# EasyEDA Pro project FrameworkGPU to MXM v0.34.epro, board PCB8
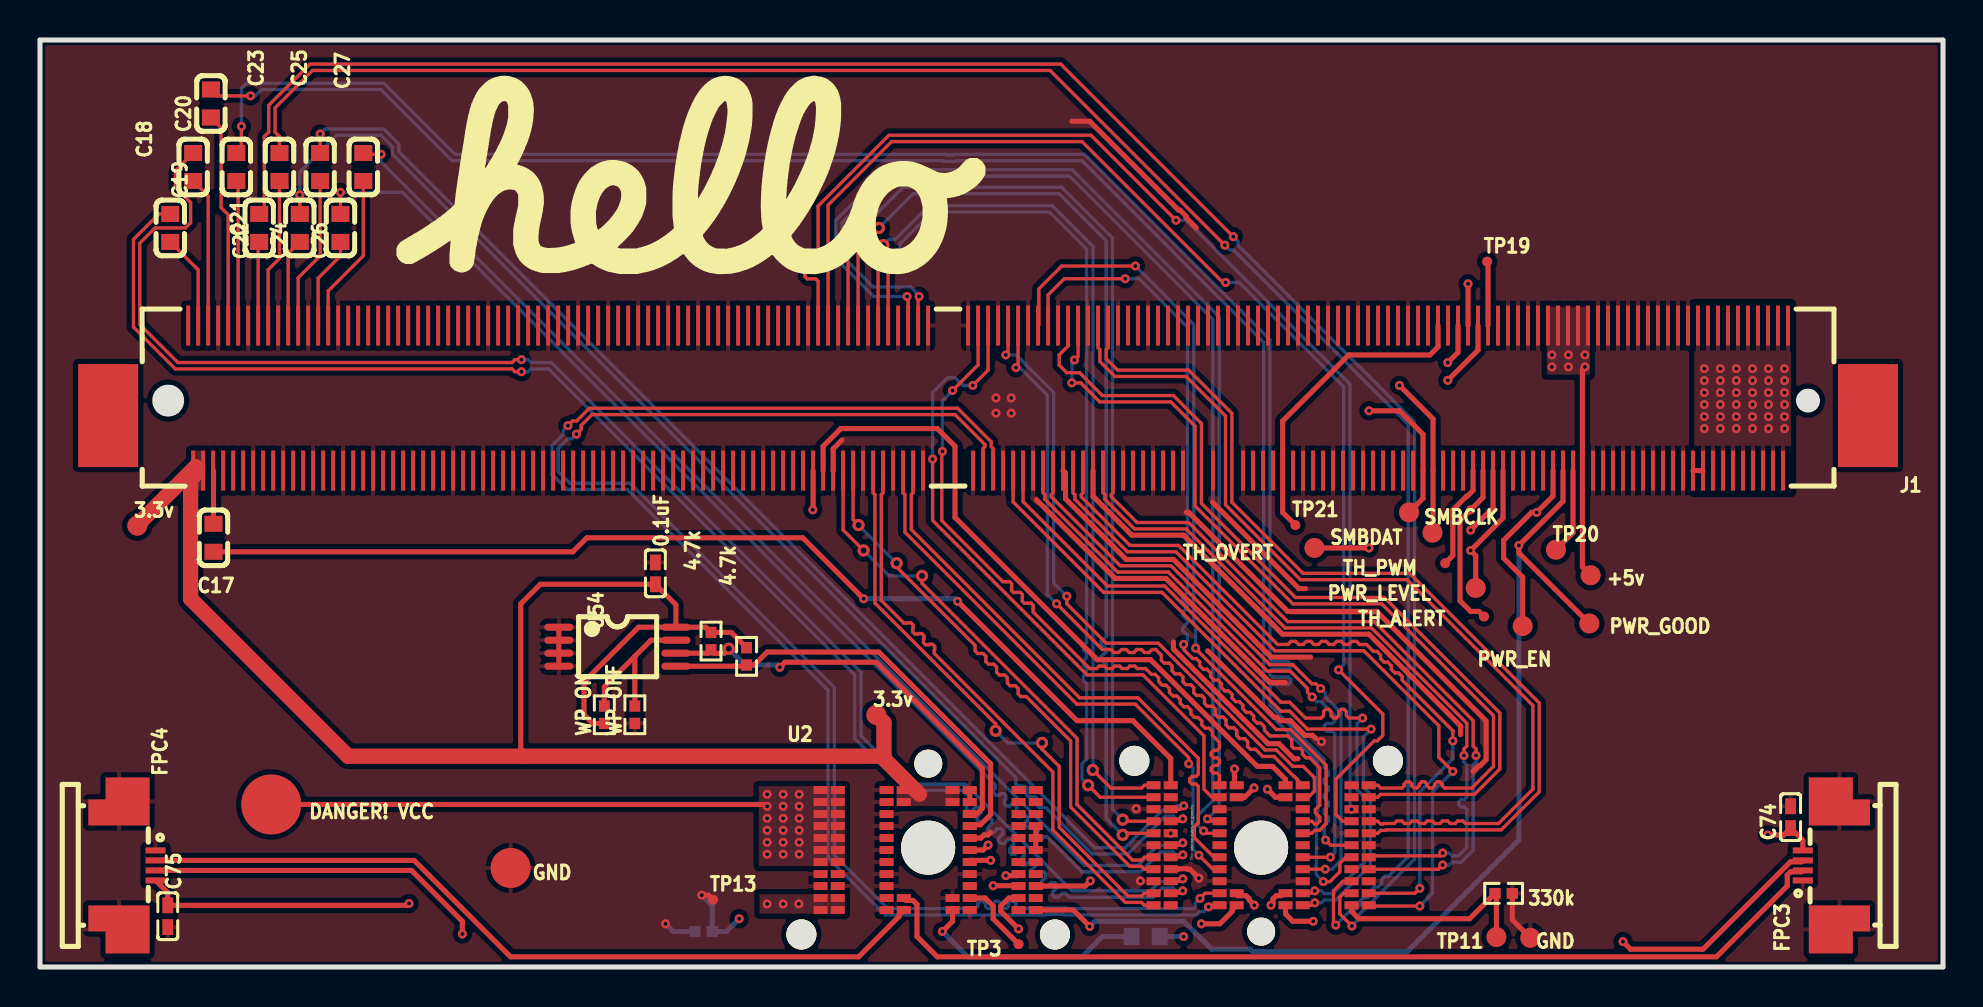
[diagram p10: board, top side]
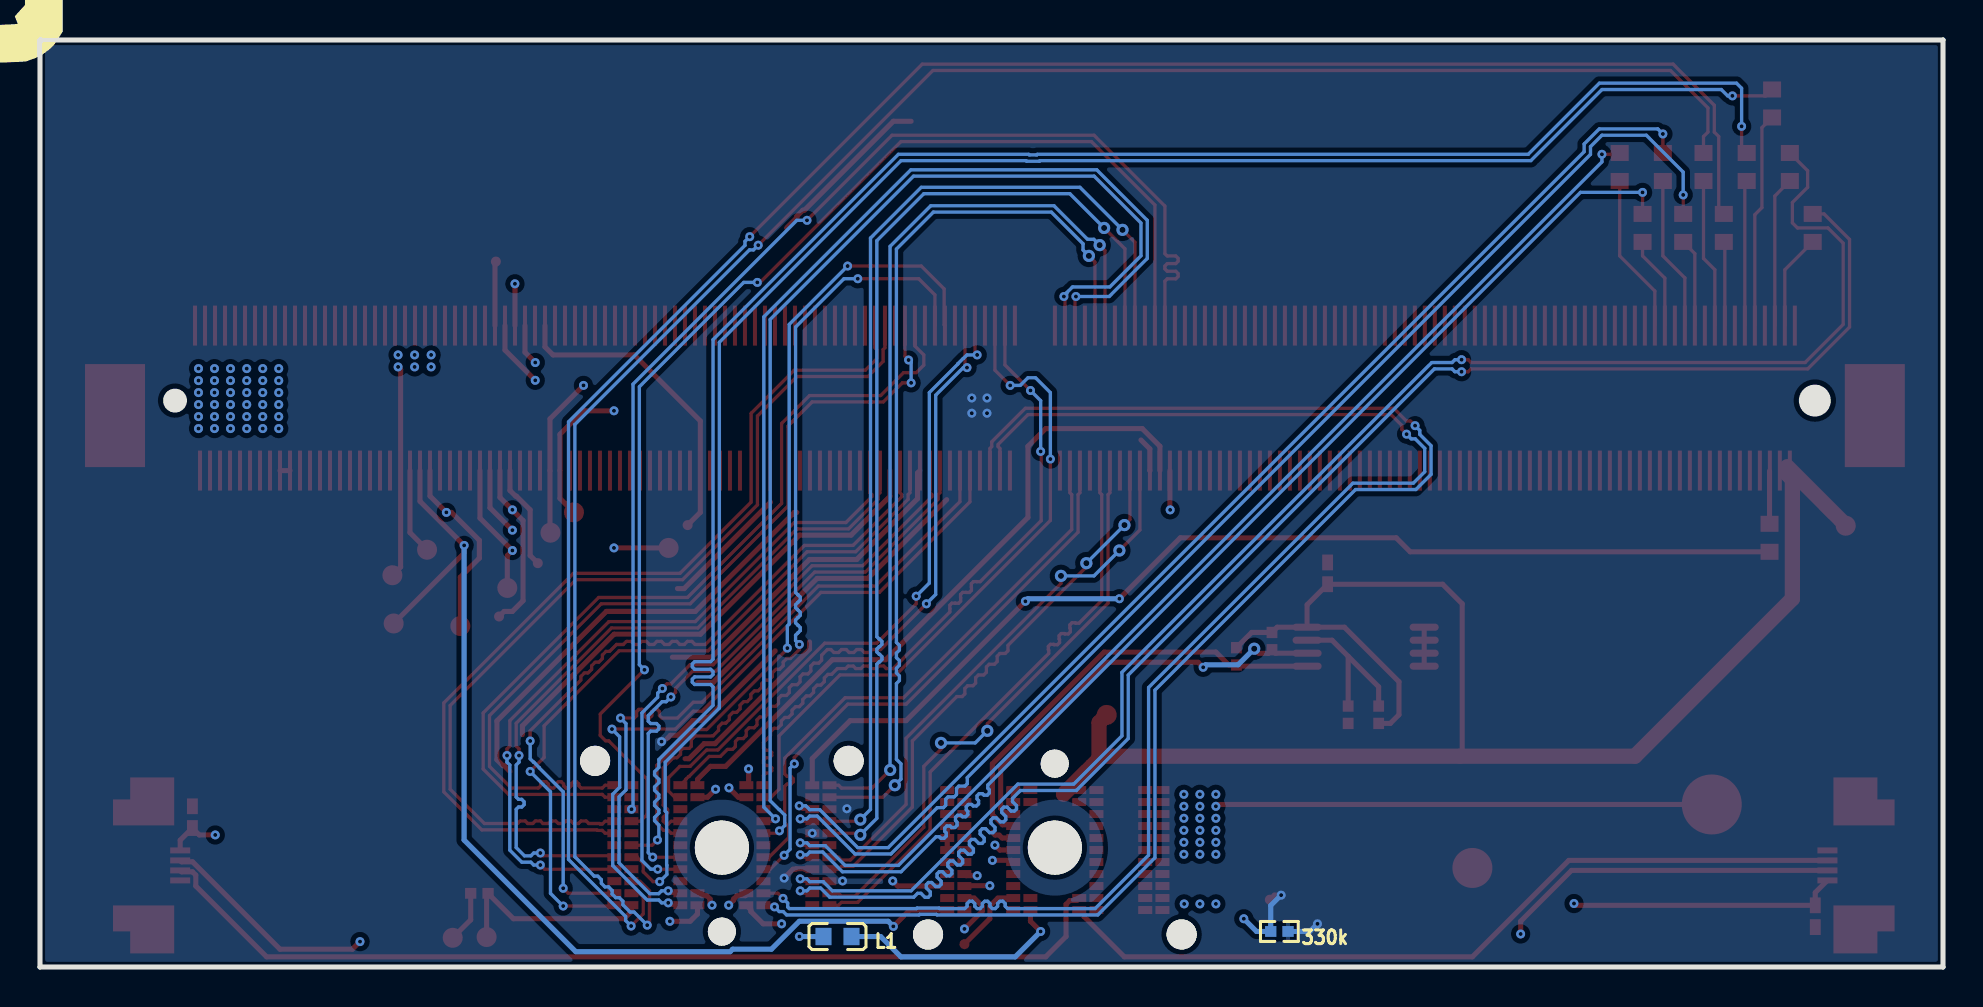
[diagram p11: board, bottom side, seen from below]

Outline 95.16 x 46.36 mm; copper layers: Top Layer, Inner1, Inner2, Inner3, Inner4, Bottom Layer. Coordinates in mm from the lower left corner of the outline.
Outline path: 0,46.36 95.16,46.36 95.16,0 0,0 0,46.36
Stack: Top Layer 0.035mm Outer layer thickness 1oz / Dielectric1 0.0994mm 3313 RC57% 4.2mil / Inner1 0.0152mm Inner layer thickness / Dielectric2 0.55mm 0.55mm H/H No copper / Inner2 0.0152mm Inner layer thickness / Dielectric3 0.1088mm 2116 RC54% 4.9mil / Inner3 0.0152mm Inner layer thickness / Dielectric4 0.55mm 0.55mm H/H No copper / Inner4 0.0152mm Inner layer thickness / Dielectric5 0.0994mm 3313 RC57% 4.2mil / Bottom Layer 0.035mm Outer layer thickness 1oz

## Design rules (mm)
net DP_A_AUXP: DP_A_AUX
net DP_A_AUXN: DP_A_AUX
net DP_A_L3P: DP_A_L3
net DP_A_L3N: DP_A_L3
net DP_A_L2P: DP_A_L2
net DP_A_L2N: DP_A_L2
net DP_A_L1P: DP_A_L1
net DP_A_L1N: DP_A_L1
net DP_A_L0P: DP_A_L0
net DP_A_L0N: DP_A_L0
net PEX_REFCLK+: DP2
net PEX_REFCLK-: DP2
net PCIE_TX_0P: PCIE_TX_0
net PCIE_RX_0P: PCIE_RX_0
net PCIE_TX_0N: PCIE_TX_0
net PCIE_RX_0N: PCIE_RX_0
net PCIE_TX_1P: PCIE_TX_1
net PCIE_RX_1P: PCIE_RX_1
net PCIE_TX_1N: PCIE_TX_1
net PCIE_RX_1N: PCIE_RX_1
net PCIE_TX_2P: PCIE_TX_2
net PCIE_RX_2P: PCIE_RX_2
net PCIE_TX_2N: PCIE_TX_2
net PCIE_RX_2N: PCIE_RX_2
net PCIE_RX_3P: PCIE_RX_3
net PCIE_TX_3P: PCIE_TX_3
net PCIE_RX_3N: PCIE_RX_3
net PCIE_TX_3N: PCIE_TX_3
net PCIE_RX_4P: PCIE_RX_4
net PCIE_TX_4P: PCIE_TX_4
net PCIE_RX_4N: PCIE_RX_4
net PCIE_TX_4N: PCIE_TX_4
net PCIE_RX_5P: PCIE_RX_5
net PCIE_TX_5P: PCIE_TX_5
net PCIE_RX_5N: PCIE_RX_5
net PCIE_TX_5N: PCIE_TX_5
net PCIE_RX_6P: DP1
net PCIE_TX_6P: PCIE_TX_6
net PCIE_RX_6N: DP1
net PCIE_TX_6N: PCIE_TX_6
net PCIE_RX_7P: PCIE_RX_7
net PCIE_TX_7P: PCIE_TX_7
net PCIE_RX_7N: PCIE_RX_7
net PCIE_TX_7N: PCIE_TX_7
template: Custom Config
spacing copperThickness1oz (default): track to track 0.102, other pairs 0.152 to 0.3
spacing copperThickness2oz: track to track 0.203, other pairs 0.152 to 0.3
track width copperThickness1oz (default): min 0.127, default 0.254, max 2.54
track width copperThickness2oz: min 0.203, default 0.254, max 2.54
differential pair differentialPair (default): width min 0.127, default 0.165, max 2.54; gap min 0.152, default 0.152
via viaSize (default): diameter min 0.45, default 0.45, max 10; hole min 0.201, default 0.201, max 6.3

## Placement (name value [footprint] x y rotation side)
0.1uF  0.1uF  [C0402]  30.77 19.69 270 top
3.3v  -  [Test-Point-0.5mm]  41.82 12.61 0 top
3.3v#2  -  [Test-Point-0.5mm]  4.86 22.07 0 top
4.7k  -  [R0402]  33.56 16.3 90 top
4.7k#2  -  [R0402]  35.33 15.53 90 top
330k  -  [R0402]  73.19 3.68 180 top
330k#2  -  [R0402]  33.19 1.78 0 bottom
+5v  -  [Test-Point-0.5mm]  77.54 19.59 0 top
C17  100nF  [C0603]  8.67 21.46 270 top
C18  100nF  [C0603]  6.52 36.96 270 top
C19  100nF  [C0603]  7.66 40 90 top
C20  100nF  [C0603]  8.55 43.18 90 top
C21  100nF  [C0603]  9.82 40 90 top
C22  100nF  [C0603]  10.96 36.96 90 top
C23  100nF  [C0603]  11.98 40 90 top
C24  100nF  [C0603]  12.99 36.96 90 top
C25  100nF  [C0603]  14.01 40 90 top
C26  100nF  [C0603]  15.02 36.96 90 top
C27  100nF  [C0603]  16.17 40 90 top
C74  0.1uF  [C0402]  87.54 7.49 90 top
C75  0.1uF  [C0402]  6.39 2.54 270 top
DANGER! VCC  -  [Test-Point-0.5mm#2]  11.56 8.13 0 top
FPC3  527460471  [FPC-SMD_4P-P0.50_MOLEX_0527460471]  89.07 5.08 90 top
FPC4  527460471  [FPC-SMD_4P-P0.50_MOLEX_0527460471]  4.86 5.08 270 top
GND  -  [Test-Point-0.5mm#3]  23.53 4.95 0 top
GND#2  -  [Test-Point-0.5mm]  74.52 1.46 0 top
J1  MXM3.0  [CONN-SMD_314P-P0.50_10151114-001TLF]  47.41 28.45 180 top
L1  100M  [L0603]  55.28 1.52 0 bottom
PWR_EN  -  [Test-Point-0.5mm]  74.14 17.05 0 top
PWR_GOOD  -  [Test-Point-0.5mm]  77.48 17.18 0 top
PWR_LEVEL  -  [Test-Point-0.5mm]  71.79 18.96 0 top
SMBCLK  -  [Test-Point-0.5mm]  68.46 22.73 0 top
SMBDAT  -  [Test-Point-0.5mm]  69.63 21.72 0 top
TH_ALERT  -  [Test-Point-0.5mm#4]  72.21 17.53 0 top
TH_OVERT  -  [Test-Point-0.5mm]  63.73 20.96 0 top
TH_PWM  -  [Test-Point-0.5mm#4]  70.27 20.19 0 top
TP3  -  [Test-Point-0.5mm#4]  48.93 1.14 0 top
TP11  -  [Test-Point-0.5mm]  72.83 1.5 0 top
TP13  -  [Test-Point-0.5mm#4]  33.66 3.37 0 top
TP19  -  [Test-Point-0.5mm#4]  72.36 35.28 0 top
TP20  -  [Test-Point-0.5mm]  75.81 20.87 0 top
TP21  -  [Test-Point-0.5mm#4]  62.78 22.1 0 top
U2  FXBeam  [FW_FXBEAM_FULL]  52.74 5.97 0 top
U54  BR24G32FVT-3GE2  [TSSOP-8_L4.4-W3.0-P0.65-LS6.4-BL]  28.87 16.02 270 top
WP OFF  100K ±1%  [R0402]  29.75 12.61 90 top
WP ON  100K ±1%  [R0402]  28.22 12.61 270 top

## Footprints (pads in the part's own frame, mm; a bottom-side part is the same pattern mirrored in y, then rotated)
C0402
  rect 0.79x0.54 smd: 1(0.545,0) 2(-0.545,0)
C0603
  rect 0.8x0.9 smd: 1(-0.7,0) 2(0.7,0)
CONN-SMD_314P-P0.50_10151114-001TLF
  rect 0.2x2 smd: 1(-30,-3.625) 3(-29.5,-3.625) 4(-29.25,3.625) 5(-29,-3.625) 6(-28.75,3.625) 7(-28.5,-3.625) 8(-28.25,3.625) 9(-28,-3.625) 10(-27.75,3.625) 11(-27.5,-3.625) 12(-27.25,3.625) 13(-27,-3.625) 14(-26.75,3.625) 15(-26.5,-3.625) 16(-26.25,3.625) 17(-26,-3.625) 18(-25.75,3.625) 19(-25.5,-3.625) 20(-25.25,3.625) 21(-25,-3.625) 22(-24.75,3.625) 23(-24.5,-3.625) 24(-24.25,3.625) 25(-24,-3.625) 26(-23.75,3.625) 27(-23.5,-3.625) 28(-23.25,3.625) 29(-23,-3.625) 30(-22.75,3.625) 31(-22.5,-3.625) 32(-22.25,3.625) 33(-22,-3.625) 34(-21.75,3.625) 35(-21.5,-3.625) 36(-21.25,3.625) 37(-21,-3.625) 38(-20.75,3.625) 39(-20.5,-3.625) 40(-20.25,3.625) 41(-20,-3.625) 42(-19.75,3.625) 43(-19.5,-3.625) 44(-19.25,3.625) 45(-19,-3.625) 46(-18.75,3.625) 47(-18.5,-3.625) 48(-18.25,3.625) 49(-18,-3.625) 50(-17.75,3.625) 51(-17.5,-3.625) 52(-17.25,3.625) 53(-17,-3.625) 54(-16.75,3.625) 55(-16.5,-3.625) 56(-16.25,3.625) 57(-16,-3.625) 58(-15.75,3.625) 59(-15.5,-3.625) 60(-15.25,3.625) 61(-15,-3.625) 63(-14.5,-3.625) 64(-14.25,3.625) 65(-14,-3.625) 66(-13.75,3.625) 67(-13.5,-3.625) 68(-13.25,3.625) 69(-13,-3.625) 70(-12.75,3.625) 71(-12.5,-3.625) 73(-12,-3.625) 75(-11.5,-3.625) 76(-11.25,3.625) 77(-11,-3.625) 79(-10.5,-3.625) 81(-10,-3.625) 82(-9.75,3.625) 83(-9.5,-3.625) 84(-9.25,3.625) 85(-9,-3.625) 86(-8.75,3.625) 87(-8.5,-3.625) 88(-8.25,3.625) 89(-8,-3.625) 90(-7.75,3.625) 91(-7.5,-3.625) 92(-7.25,3.625) 93(-7,-3.625) 94(-6.75,3.625) 95(-6.5,-3.625) 96(-6.25,3.625) 97(-6,-3.625) 98(-5.75,3.625) 99(-5.5,-3.625) 100(-5.25,3.625) 101(-5,-3.625) 102(-4.75,3.625) 103(-4.5,-3.625) 104(-4.25,3.625) 105(-4,-3.625) 106(-3.75,3.625) 107(-3.5,-3.625) 108(-3.25,3.625) 109(-3,-3.625) 110(-2.75,3.625) 111(-2.5,-3.625) 112(-2.25,3.625) 113(-2,-3.625) 114(-1.75,3.625) 115(-1.5,-3.625) 116(-1.25,3.625) 117(-1,-3.625) 118(-0.75,3.625) 119(-0.5,-3.625) 120(-0.25,3.625) 121(-0.001,-3.625) 122(0.25,3.625) 123(0.5,-3.625) 124(0.75,3.625) 125(1,-3.625) 133(3,-3.625) 134(3.249,3.625) 135(3.5,-3.625) 136(3.75,3.625) 137(4,-3.625) 138(4.25,3.625) 139(4.5,-3.625) 140(4.75,3.625) 141(5,-3.625) 142(5.25,3.625) 143(5.5,-3.625) 144(5.75,3.625) 145(6,-3.625) 146(6.25,3.625) 147(6.5,-3.625) 148(6.75,3.625) 149(7,-3.625) 150(7.25,3.625) 151(7.5,-3.625) 152(7.75,3.625) 153(8,-3.625) 154(8.25,3.625) 155(8.5,-3.625) 156(8.75,3.625) 157(9,-3.625) 158(9.25,3.625) 159(9.5,-3.625) 160(9.75,3.625) 161(10,-3.625) 162(10.25,3.625) 163(10.5,-3.625) 164(10.75,3.625) 165(11,-3.625) 166(11.25,3.625) 167(11.5,-3.625) 168(11.75,3.625) 169(12,-3.625) 170(12.25,3.625) 171(12.5,-3.625) 172(12.75,3.625) 173(13,-3.625) 174(13.25,3.625) 175(13.5,-3.625) 176(13.75,3.625) 177(14,-3.625) 178(14.25,3.625) 179(14.5,-3.625) 180(14.75,3.625) 181(15,-3.625) 182(15.25,3.625) 183(15.5,-3.625) 184(15.75,3.625) 185(16,-3.625) 186(16.25,3.625) 187(16.5,-3.625) 188(16.75,3.625) 189(17,-3.625) 190(17.25,3.625) 191(17.5,-3.625) 192(17.75,3.625) 193(18,-3.625) 194(18.25,3.625) 195(18.5,-3.625) 196(18.75,3.625) 197(19,-3.625) 198(19.25,3.625) 199(19.5,-3.625) 200(19.75,3.625) 201(20,-3.625) 202(20.25,3.625) 203(20.5,-3.625) 204(20.75,3.625) 205(21,-3.625) 206(21.25,3.625) 207(21.5,-3.625) 208(21.75,3.625) 209(22,-3.625) 210(22.25,3.625) 211(22.5,-3.625) 212(22.75,3.625) 213(23,-3.625) 214(23.25,3.625) 215(23.5,-3.625) 216(23.75,3.625) 217(24,-3.625) 218(24.25,3.625) 219(24.5,-3.625) 220(24.75,3.625) 221(25,-3.625) 222(25.25,3.625) 223(25.5,-3.625) 224(25.75,3.625) 225(26,-3.625) 226(26.25,3.625) 227(26.5,-3.625) 228(26.75,3.625) 229(27,-3.625) 230(27.25,3.625) 231(27.5,-3.625) 232(27.75,3.625) 233(28,-3.625) 234(28.25,3.625) 235(28.5,-3.625) 236(28.75,3.625) 237(29,-3.625) 238(29.25,3.625) 239(29.5,-3.625) 240(29.75,3.625) 241(30,-3.625) 242(30.25,3.625) 243(30.5,-3.625) 244(30.75,3.625) 245(31,-3.625) 246(31.25,3.625) 247(31.5,-3.625) 248(31.75,3.625) 249(32,-3.625) 250(32.25,3.625) 251(32.5,-3.625) 252(32.75,3.625) 253(33,-3.625) 254(33.25,3.625) 255(33.5,-3.625) 256(33.75,3.625) 257(34,-3.625) 258(34.25,3.625) 259(34.5,-3.625) 260(34.75,3.625) 261(35,-3.625) 262(35.25,3.625) 263(35.5,-3.625) 264(35.75,3.625) 265(36,-3.625) 266(36.25,3.625) 267(36.5,-3.625) 268(36.75,3.625) 269(37,-3.625) 270(37.25,3.625) 271(37.5,-3.625) 272(37.75,3.625) 273(38,-3.625) 274(38.25,3.625) 275(38.5,-3.625) 276(38.75,3.625) 277(39,-3.625) 278(39.25,3.625) 279(39.5,-3.625) 280(39.75,3.625) 281(40,-3.625) E1(-40,-3.625) E1(-39.5,-3.625) E1(-39,-3.625) E1(-38.5,-3.625) E1(-38,-3.625) E1(-37.5,-3.625) E1(-37,-3.625) E1(-36.5,-3.625) E1(-36,-3.625) E1(-35.5,-3.625) E2(-39.75,3.625) E2(-39.25,3.625) E2(-38.75,3.625) E2(-38.25,3.625) E2(-37.75,3.625) E2(-37.25,3.625) E2(-36.75,3.625) E2(-36.25,3.625) E2(-35.75,3.625) E2(-35.25,3.625) E3(-35,-3.625) E3(-34.5,-3.625) E3(-34,-3.625) E3(-33.5,-3.625) E3(-33,-3.625) E3(-32.5,-3.625) E3(-32,-3.625) E3(-31.5,-3.625) E3(-31,-3.625) E3(-30.5,-3.625) E4(-34.75,3.625) E4(-34.25,3.625) E4(-33.75,3.625) E4(-33.25,3.625) E4(-32.75,3.625) E4(-32.25,3.625) E4(-31.75,3.625) E4(-31.25,3.625) E4(-30.75,3.625) E4(-30.25,3.625)
  rect 3x5.15 smd: 282(44,0.875) 283(-44,0.875)
FPC-SMD_4P-P0.50_MOLEX_0527460471
  rect 0.3x1 smd: 1(-0.75,0.915) 2(-0.25,0.915) 3(0.25,0.915) 4(0.75,0.915)
  custom 2.4x3.06 smd: 5(3.2,-0.915) 6(-3.2,-0.915)
FW_FXBEAM_FULL
  round 1.5 hole 1.5: (-14.67,-4.34) (-1.99,-4.345) (1.98,4.34) (14.66,4.34)
  round 2.7 hole 2.7: (-8.33,0) (8.32,0)
  round 1.4 hole 1.4: (-8.325,4.2) (8.32,-4.2)
  rect 0.7x0.4 smd: PA1(-2.95,2.88) PA2(-3.81,2.88) PA3(-6.25,2.88) PA4(-7.11,2.88) PA5(-9.55,2.88) PA6(-10.41,2.88) PA7(-12.85,2.88) PA8(-13.71,2.88) PB1(-2.95,2.28) PB2(-3.81,2.28) PB3(-6.25,2.28) PB4(-7.11,2.28) PB5(-9.55,2.28) PB6(-10.41,2.28) PB7(-12.85,2.28) PB8(-13.71,2.28) PC1(-2.95,1.68) PC2(-3.81,1.68) PC3(-6.25,1.68) PC6(-10.41,1.68) PC7(-12.85,1.68) PC8(-13.71,1.68) PD1(-2.95,1.08) PD2(-3.81,1.08) PD3(-6.25,1.08) PD6(-10.41,1.08) PD7(-12.85,1.08) PD8(-13.71,1.08) PE1(-2.95,0.48) PE2(-3.81,0.48) PE3(-6.25,0.48) PE6(-10.41,0.48) PE7(-12.85,0.48) PE8(-13.71,0.48) PF1(-2.95,-0.12) PF2(-3.81,-0.12) PF3(-6.25,-0.12) PF6(-10.41,-0.12) PF7(-12.85,-0.12) PF8(-13.71,-0.12) PG1(-2.95,-0.72) PG2(-3.81,-0.72) PG3(-6.25,-0.72) PG6(-10.41,-0.72) PG7(-12.85,-0.72) PG8(-13.71,-0.72) PH1(-2.95,-1.32) PH2(-3.81,-1.32) PH3(-6.25,-1.32) PH6(-10.41,-1.32) PH7(-12.85,-1.32) PH8(-13.71,-1.32) PJ1(-2.95,-1.92) PJ2(-3.81,-1.92) PJ3(-6.25,-1.92) PJ6(-10.41,-1.92) PJ7(-12.85,-1.92) PJ8(-13.71,-1.92) PK1(-2.95,-2.52) PK2(-3.81,-2.52) PK3(-6.25,-2.52) PK4(-7.11,-2.52) PK5(-9.55,-2.52) PK6(-10.41,-2.52) PK7(-12.85,-2.52) PK8(-13.71,-2.52) PL1(-2.95,-3.12) PL2(-3.81,-3.12) PL3(-6.25,-3.12) PL4(-7.11,-3.12) PL5(-9.55,-3.12) PL6(-10.41,-3.12) PL7(-12.85,-3.12) PL8(-13.71,-3.12) SA1(13.7,3.12) SA2(12.84,3.12) SA3(10.4,3.12) SA4(9.54,3.12) SA5(7.1,3.12) SA6(6.24,3.12) SA7(3.8,3.12) SA8(2.94,3.12) SB1(13.7,2.52) SB2(12.84,2.52) SB3(10.4,2.52) SB4(9.54,2.52) SB5(7.1,2.52) SB6(6.24,2.52) SB7(3.8,2.52) SB8(2.94,2.52) SC1(13.7,1.92) SC2(12.84,1.92) SC3(10.4,1.92) SC6(6.24,1.92) SC7(3.8,1.92) SC8(2.94,1.92) SD1(13.7,1.32) SD2(12.84,1.32) SD3(10.4,1.32) SD6(6.24,1.32) SD7(3.8,1.32) SD8(2.94,1.32) SE1(13.7,0.72) SE2(12.84,0.72) SE3(10.4,0.72) SE6(6.24,0.72) SE7(3.8,0.72) SE8(2.94,0.72) SF1(13.7,0.12) SF2(12.84,0.12) SF3(10.4,0.12) SF6(6.24,0.12) SF7(3.8,0.12) SF8(2.94,0.12) SG1(13.7,-0.48) SG2(12.84,-0.48) SG3(10.4,-0.48) SG6(6.24,-0.48) SG7(3.8,-0.48) SG8(2.94,-0.48) SH1(13.7,-1.08) SH2(12.84,-1.08) SH3(10.4,-1.08) SH6(6.24,-1.08) SH7(3.8,-1.08) SH8(2.94,-1.08) SJ1(13.7,-1.68) SJ2(12.84,-1.68) SJ3(10.4,-1.68) SJ6(6.24,-1.68) SJ7(3.8,-1.68) SJ8(2.94,-1.68) SK1(13.7,-2.28) SK2(12.84,-2.28) SK3(10.4,-2.28) SK4(9.54,-2.28) SK5(7.1,-2.28) SK6(6.24,-2.28) SK7(3.8,-2.28) SK8(2.94,-2.28) SL1(13.7,-2.88) SL2(12.84,-2.88) SL3(10.4,-2.88) SL4(9.54,-2.88) SL5(7.1,-2.88) SL6(6.24,-2.88) SL7(3.8,-2.88) SL8(2.94,-2.88)
L0603
  rect 0.8x0.864 smd: 1(-0.7,0) 2(0.7,0)
R0402
  rect 0.566x0.54 smd: 1(-0.433,0) 2(0.433,0)
Test-Point-0.5mm
  round 1 smd: 1(0,0)
Test-Point-0.5mm#2
  round 3 smd: 1(0,0)
Test-Point-0.5mm#3
  round 2 smd: 1(0,0)
Test-Point-0.5mm#4
  round 0.5 smd: 1(0,0)
TSSOP-8_L4.4-W3.0-P0.65-LS6.4-BL
  oval 0.353x1.454 smd: 1(-0.975,-2.927) 2(-0.325,-2.927) 3(0.325,-2.927) 4(0.975,-2.927) 5(0.975,2.927) 6(0.325,2.927) 7(-0.325,2.927) 8(-0.975,2.927)

## Nets
12V_FAN: C74.2 C75.2 FPC3.4 FPC4.4 L1.2
+3.3V: 0.1uF.1 3.3v.1 3.3v#2.1 4.7k.2 4.7k#2.2 J1.278 J1.280 U2.PA4 U2.PA5 U2.PB4 U2.PB5 U54.8 WP ON.2
+5V: +5v.1 J1.1 J1.3 J1.5 J1.7 J1.9 U2.PK7 U2.PK8 U2.PL7 U2.PL8
GND: 0.1uF.2 330k.1 330k#2.1 C74.1 C75.1 FPC3.1 FPC3.5 FPC3.6 FPC4.1 FPC4.5 FPC4.6 GND.1 GND#2.1 J1.11 J1.13 J1.15 J1.17 J1.36 J1.37 J1.46 J1.47 J1.52 J1.53 J1.58 J1.59 J1.64 J1.65 J1.70 J1.71 J1.76 J1.77 J1.82 J1.83 J1.88 J1.89 J1.94 J1.95 J1.100 J1.101 J1.106 J1.107 J1.112 J1.113 J1.118 J1.119 J1.124 J1.125 J1.133 J1.134 J1.139 J1.140 J1.145 J1.146 J1.151 J1.152 J1.157 J1.166 J1.173 J1.174 J1.179 J1.180 J1.185 J1.186 J1.191 J1.192 J1.197 J1.198 J1.203 J1.204 J1.209 J1.210 J1.215 J1.216 J1.221 J1.222 J1.228 J1.244 J1.250 J1.251 J1.256 J1.257 J1.262 J1.263 J1.268 J1.269 J1.275 J1.E3 J1.E4 U2.PA3 U2.PA6 U2.PB3 U2.PB6 U2.PC6 U2.PD1 U2.PD2 U2.PD6 U2.PE1 U2.PE2 U2.PE3 U2.PE6 U2.PF1 U2.PF6 U2.PG6 U2.PH3 U2.PH6 U2.PH7 U2.PH8 U2.PJ6 U2.PJ7 U2.PJ8 U2.PK4 U2.PK6 U2.PL3 U2.PL6 U2.SB2 U2.SB7 U2.SC1 U2.SC3 U2.SC6 U2.SC8 U2.SE2 U2.SE7 U2.SF1 U2.SF3 U2.SF6 U2.SF8 U2.SH2 U2.SH7 U2.SJ1 U2.SJ3 U2.SJ6 U2.SJ8 U54.1 U54.2 U54.3 U54.4 WP OFF.1
VCC: DANGER! VCC.1 J1.E1 J1.E2 U2.PA7 U2.PA8 U2.PB7 U2.PB8 U2.PC7 U2.PC8 U2.PD7 U2.PD8 U2.PE7 U2.PE8 U2.PF7 U2.PF8 U2.PG7 U2.PG8
BK_I2C_SCL: 4.7k.1 U2.PC3 U54.6
BK_I2C_SDA: 4.7k#2.1 U2.PD3 U54.5
DP_A_AUXN: C19.1 C19.2 J1.277 U2.SJ7
DP_A_AUXP: C18.1 C18.2 J1.279 U2.SK7
DP_A_HPD: C17.1 J1.276
DP_A_L0N: C27.1 C27.2 J1.253 U2.SF7
DP_A_L0P: C26.1 C26.2 J1.255 U2.SG7
DP_A_L1N: C25.1 C25.2 J1.259 U2.SC7
DP_A_L1P: C24.1 C24.2 J1.261 U2.SD7
DP_A_L2N: C23.1 C23.2 J1.265 U2.SJ2
DP_A_L2P: C22.1 C22.2 J1.267 U2.SK2
DP_A_L3N: C21.1 C21.2 J1.271 U2.SF2
DP_A_L3P: C20.1 C20.2 J1.273 U2.SG2
FAN1_PWM: FPC3.2 U2.PK5
FAN1_SPEED: FPC3.3 U2.PJ2
FAN2_PWM: FPC4.2 U2.PL5
FAN2_SPEED: FPC4.3 U2.PH2
PCIE_RX_0N: J1.147 U2.SE8
PCIE_RX_0P: J1.149 U2.SD8
PCIE_RX_1N: J1.141 U2.SB8
PCIE_RX_1P: J1.143 U2.SA8
PCIE_RX_2N: J1.135 U2.SE6
PCIE_RX_2P: J1.137 U2.SD6
PCIE_RX_3N: J1.121 U2.SB6
PCIE_RX_3P: J1.123 U2.SA6
PCIE_RX_4N: J1.115 U2.SA3
PCIE_RX_4P: J1.117 U2.SB3
PCIE_RX_5N: J1.109 U2.SD3
PCIE_RX_5P: J1.111 U2.SE3
PCIE_RX_6N: J1.103 U2.SA1
PCIE_RX_6P: J1.105 U2.SB1
PCIE_RX_7N: J1.97 U2.SE1
PCIE_RX_7P: J1.99 U2.SD1
PCIE_TX_0N: J1.148 U2.SH8
PCIE_TX_0P: J1.150 U2.SG8
PCIE_TX_1N: J1.142 U2.SL8
PCIE_TX_1P: J1.144 U2.SK8
PCIE_TX_2N: J1.136 U2.SG6
PCIE_TX_2P: J1.138 U2.SH6
PCIE_TX_3N: J1.120 U2.SL6
PCIE_TX_3P: J1.122 U2.SK6
PCIE_TX_4N: J1.114 U2.SK3
PCIE_TX_4P: J1.116 U2.SL3
PCIE_TX_5N: J1.108 U2.SH3
PCIE_TX_5P: J1.110 U2.SG3
PCIE_TX_6N: J1.102 U2.SK1
PCIE_TX_6P: J1.104 U2.SL1
PCIE_TX_7N: J1.96 U2.SH1
PCIE_TX_7P: J1.98 U2.SG1
PEX_CLK_REQ-: J1.154 U2.SA4
PEX_REFCLK+: J1.155 U2.SC2
PEX_REFCLK-: J1.153 U2.SD2
PEX_RST: J1.156 U2.SA5
PNL_BL_EN: J1.25 U2.SL4
PNL_BL_PWM: J1.27 U2.SK4
PNL_PWR_EN: J1.23 U2.SK5
PWR_EN: J1.8 PWR_EN.1 U2.PK2
PWR_GOOD: J1.6 PWR_GOOD.1 U2.PL1
PWR_LEVEL: J1.18 PWR_LEVEL.1 U2.SB4
SMB_CLK: J1.34 SMBCLK.1 U2.PF3
SMB_DAT: J1.32 SMBDAT.1 U2.PG3
TH_ALERT: J1.22 TH_ALERT.1 U2.SB5
TH_OVERT: J1.20 TH_OVERT.1 U2.SL5
TH_PWM: J1.24 TH_PWM.1
$1N14229: C17.2 U2.SA7
$1N14285: U54.7 WP OFF.2 WP ON.1
$1N14298: 330k.2 TP11.1 U2.SL2
$1N14304: L1.1 U2.PL4
$1N14305: TP3.1 U2.PK3
$1N14306: U2.PJ3
$1N14307: U2.PG1
$1N14308: U2.PH1
$1N14309: U2.PF2
$1N14310: U2.PG2
$1N14311: J1.21 TP19.1
$1N14312: J1.4 TP20.1
$1N14313: J1.31 TP21.1
$1N14335: 330k#2.2 TP13.1 U2.PJ1

Pads without a net: J1 10 12 14 16 19 26 28 29 30 33 35 38 39 40 41 42 43 44 45 48 49 50 51 54 55 56 57 60 61 63 66 67 68 69 73 75 79 81 84 85 86 87 90 91 92 93 158 159 160 161 162 163 164 165 167 168 169 170 171 172 175 176 177 178 181 182 183 184 187 188 189 190 193 194 195 196 199 200 201 202 205 206 207 208 211 212 213 214 217 218 219 220 223 224 225 226 227 229 230 231 232 233 234 235 236 237 238 239 240 241 242 243 245 246 247 248 249 252 254 258 260 264 266 270 272 274 281 282 283; U2 PA1 PA2 PB1 PB2 PC1 PC2 PK1 PL2 SA2 SL7

## Via types
v1: diameter 0.45, hole 0.201, Top Layer to Bottom Layer, 174 vias
v2: diameter 0.61, hole 0.305, Top Layer to Bottom Layer, 15 vias

## Routing (per net, layer and track width the routed paths; a pad name or vN(x,y) marks a point on that pad's centre or on a via; arc(x,y) is an arc through that point)
12V_FAN: length 99.5
  Top Layer w0.254: FPC4.4 6.39,3.72 6.39,3.08 18.36,3.08 v1(18.45,3.17) ; v1(86.4,6.6) 87.2,6.6 C74.2 88.15,6.34 FPC3.4
  Inner3 w0.254: v1(18.45,3.17) 32.68,3.17 35.34,0.51 39.79,0.51 41.95,2.67 41.95,6.86 43.73,8.64 47.41,8.64 54.52,1.52 v1(57.19,1.52) 58.46,1.52 59.86,2.92 59.86,3.43 60.24,3.81 62.14,3.81 63.28,4.95 63.28,7.11 63.46,7.29 85.71,7.29 v1(86.4,6.6)
  Bottom Layer w0.254: v1(57.19,1.52) L1.2
+3.3V: length 83.1
  Top Layer w0.254: 24.15,10.54 24.04,10.65 24.04,18.16 25.02,19.14 0.1uF.1 31.8,18.11 U54.8 ; 4.7k#2.2 34.57,16.73 4.7k.2 33.29,16.99 U54.8 ; U54.8 29.93,16.99 27.2,14.27 27.2,12.61 27.64,12.18 28.22,12.18
  Top Layer w0.762: 43.98,8.64 42.2,10.41 ; 3.3v.1 42.2,12.22 42.2,10.54 15.41,10.54 7.53,18.42 7.53,24.38 7.79,24.64 ; 7.79,25.02 4.86,22.1 3.3v#2.1
+5V: length 10.6
  Top Layer w0.254: v1(77.25,30.01) 77.13,29.88 77.13,20 +5v.1
  vias: v1(36.36,3.16) v1(37.16,3.16) v1(37.94,3.16) v1(75.6,30.61) v1(75.6,30.01) v1(76.43,30.61) v1(76.43,30.01) v1(77.25,30.61)
GND: length 123.7
  Top Layer w0.254: 49.79,7.05 49.79,5.85 ; U2.SH7 56.91,4.89 56.94,4.91 57.36,4.91 57.38,4.89 57.51,4.89 v1(57.95,4.44) ; 56.68,16.26 56.68,15.9 61.41,11.17 61.96,11.17 62.71,10.41 62.9,10.41 ; 58.63,23.24 62.95,18.92 63.28,18.92 ; J1.152 39.66,24.83 39.66,25.91 40.11,26.35 ; J1.100 52.66,23.54 54.6,21.6 57.18,21.6 62.13,16.64 66.45,16.64 71.04,12.06 71.04,11.63 ; U2.PE3 47.05,6.45 47.2,6.6 47.41,6.6 47.54,6.73 ; U2.PB3 U2.PA3 ; 63.54,15.49 61.57,15.49 56.68,20.38 54.32,20.38 51.28,23.42 51.28,24.7 J1.106 ; U54.1 U54.2 U54.3 U54.4 ; 71.67,9.78 71.96,10.07 72.02,10.07 72.31,10.37 72.31,12.31 66.84,17.78 62.4,17.78 57.44,22.73 57.32,22.73 ; 58.4,15.81 61.72,12.48 61.85,12.48 62.01,12.32 62.52,12.32 63.25,11.59 63.64,11.59 63.79,11.43 ; 49.82,23.37 53.76,19.43 56.3,19.43 61.51,14.22 62.27,14.22 ; 51.6,42.29 52.49,42.29 56.94,37.84 57.02,37.84 57.31,37.55 57.31,37.47 57.82,36.96 ; 330k.1 73.62,2.36 GND#2.1
  Bottom Layer w0.254: v1(31.28,2.16) 31.66,1.78 330k#2.1
  vias: v1(47.81,28.45) v1(47.81,27.69) v1(48.57,28.45) v1(48.57,27.69) v1(54.81,7.91) v1(55.03,4.3) v1(56.54,6.69) v1(64.08,11.27)
VCC: length 25.3
  Top Layer w0.254: DANGER! VCC.1 36.27,8.13 v1(36.36,8.04) ; J1.E2 J1.E2
  vias: v1(36.36,8.64) v1(36.36,7.44) v1(36.36,6.84) v1(36.36,6.24) v1(36.36,5.64) v1(37.16,8.64) v1(37.16,8.04) v1(37.16,7.44) v1(37.16,6.84) v1(37.16,6.24) v1(37.16,5.64) v1(37.96,8.64) v1(37.96,8.04) v1(37.96,7.44) v1(37.96,6.84) v1(37.96,6.24) v1(37.96,5.64) v1(83.22,29.92) v1(83.22,29.32) v1(83.22,28.72) v1(83.22,28.12) v1(83.22,27.52) v1(83.22,26.92) v1(84.02,29.92) v1(84.02,29.32) v1(84.02,28.72) v1(84.02,28.12) v1(84.02,27.52) v1(84.02,26.92) v1(84.82,29.92) v1(84.82,29.32) v1(84.82,28.72) v1(84.82,28.12) v1(84.82,27.52) v1(84.82,26.92) v1(85.64,29.92) v1(85.64,29.32) v1(85.64,28.72) v1(85.64,28.12) v1(85.64,27.52) v1(85.64,26.92) v1(86.44,29.92) v1(86.44,29.32) v1(86.44,28.72) v1(86.44,28.12) v1(86.44,27.52) v1(86.44,26.92) v1(87.24,29.92) v1(87.24,29.32) v1(87.24,28.72) v1(87.24,28.12) v1(87.24,27.52) v1(87.24,26.92)
BK_I2C_SCL: length 21
  Top Layer w0.254: U2.PC3 46.84,7.65 47.12,7.93 47.12,9.94 41.82,15.24 37.25,15.24 v1(37,14.99) ; v2(34.44,15.92) 34.21,15.69 33.73,15.69 4.7k.1 33.38,15.69 U54.6
  Bottom Layer w0.254: v2(34.44,15.92) 35.25,15.11 36.87,15.11 v1(37,14.99)
BK_I2C_SDA: length 22.2
  Top Layer w0.254: U2.PD3 46.56,7.11 47.03,7.11 47.54,7.62 47.54,10.16 41.95,15.75 36.36,15.75 35.72,15.1 4.7k#2.1 35.27,15.04 U54.5
DP_A_AUXN: length 85.5
  Top Layer w0.165: J1.277 8.41,38.55 C19.1 ; U2.SJ7 57.03,4.29 v1(57.15,4.41) ; C19.2 6.77,39.82 6.77,38.99 7.53,38.23 7.53,37.21 7.28,36.96 5.75,36.96 4.99,36.19 4.99,32.13 6.9,30.23 23.6,30.23 23.74,30.37 v1(24.08,30.37)
  Bottom Layer w0.165: v1(24.08,30.37) 24.41,30.37 24.55,30.23 25.57,30.23 41.06,14.73 41.06,11.56 43.47,9.14 46.27,9.14 51.6,3.81 55.54,3.81 56,4.27 56.67,4.27 56.81,4.41 v1(57.15,4.41)
DP_A_AUXP: length 85.5
  Top Layer w0.165: v1(24.08,29.77) 23.74,29.77 23.6,29.91 6.77,29.91 4.67,32 4.67,36.39 5.95,37.66 C18.1 ; J1.279 7.91,34.86 C18.2 ; v1(57.15,3.81) 57.03,3.69 U2.SK7
  Bottom Layer w0.165: v1(57.15,3.81) 56.81,3.81 56.67,3.95 56.13,3.95 55.67,3.49 51.47,3.49 51.28,3.69 51.11,3.69 50.91,3.49 50.74,3.49 50.64,3.59 50.64,3.75 50.84,3.96 50.84,4.12 50.74,4.22 50.57,4.22 50.37,4.02 50.21,4.02 50.1,4.13 50.1,4.29 50.3,4.49 50.3,4.66 50.2,4.76 50.03,4.76 49.83,4.56 49.67,4.56 49.56,4.67 49.56,4.83 49.76,5.03 49.76,5.2 49.66,5.3 49.49,5.3 49.29,5.1 49.13,5.1 49.02,5.21 49.02,5.37 49.22,5.57 49.22,5.74 49.12,5.84 48.96,5.84 48.75,5.64 48.59,5.64 48.48,5.75 48.48,5.91 48.69,6.11 48.69,6.28 48.58,6.38 48.42,6.38 48.22,6.18 48.05,6.18 47.95,6.28 47.95,6.45 48.15,6.65 48.15,6.81 48.04,6.92 47.88,6.92 47.68,6.72 47.51,6.72 47.41,6.82 47.41,6.99 47.61,7.19 47.61,7.35 47.5,7.46 47.34,7.46 47.14,7.26 46.97,7.26 46.87,7.36 46.87,7.53 47.07,7.73 47.07,7.89 46.97,8 46.8,8 46.6,7.8 46.43,7.8 46.33,7.9 46.33,8.06 46.53,8.27 46.53,8.43 46.13,8.83 43.34,8.83 40.74,11.43 40.74,14.6 25.43,29.91 24.55,29.91 24.41,29.77 v1(24.08,29.77)
DP_A_HPD: length 2.6
  Top Layer w0.254: 8.67,24.81 C17.1
DP_A_L0N: length 65
  Top Layer w0.165: C27.1 16.17,35.56 14.41,33.8 J1.253 ; v1(57.15,6.21) 57.03,6.09 U2.SF7 ; v1(17.06,40.64) 16.23,40.64 C27.2
  Bottom Layer w0.165: v1(57.15,6.21) 56.81,6.21 56.67,6.07 55.89,6.07 54.9,5.08 52.24,5.08 17.06,40.26 v1(17.06,40.64)
DP_A_L0P: length 65.1
  Top Layer w0.165: v1(15.02,38.73) C26.2 ; J1.255 13.91,34.44 15.02,35.56 C26.1 ; v1(57.15,5.61) 57.03,5.49 U2.SG7
  Bottom Layer w0.165: v1(57.15,5.61) 56.81,5.61 56.67,5.75 56.02,5.75 55.03,4.76 52.1,4.76 50.35,6.51 50.19,6.51 50.11,6.44 49.95,6.44 49.84,6.54 49.84,6.71 49.92,6.78 49.92,6.95 49.81,7.05 49.65,7.05 49.57,6.98 49.41,6.98 49.3,7.08 49.3,7.25 49.38,7.32 49.38,7.49 49.28,7.59 49.11,7.59 49.04,7.51 48.87,7.51 48.77,7.62 48.77,7.78 48.84,7.86 48.84,8.02 48.74,8.13 48.57,8.13 48.5,8.05 48.33,8.05 48.23,8.16 48.23,8.32 48.3,8.4 48.3,8.56 48.2,8.67 48.03,8.67 47.96,8.59 47.79,8.59 47.69,8.7 47.69,8.86 47.76,8.94 47.76,9.1 18.13,38.73 v1(15.02,38.73)
DP_A_L1N: length 68.6
  Top Layer w0.165: C25.1 14.01,35.56 12.91,34.46 J1.259 ; U2.SC7 57.02,7.89 v1(57.19,8.06) ; v1(14.01,41.66) C25.2
  Bottom Layer w0.165: v1(14.01,41.66) 14.26,41.91 17.19,41.91 17.95,41.15 17.95,40.77 52.74,5.97 54.27,5.97 56.17,7.87 56.67,7.87 56.86,8.06 v1(57.19,8.06)
DP_A_L1P: length 68.6
  Top Layer w0.165: J1.261 12.41,35.67 C24.1 ; U2.SD7 57.03,7.29 v1(57.15,7.41) ; v1(12.99,38.61) C24.2
  Bottom Layer w0.165: v1(12.99,38.61) 12.99,39.75 14.83,41.59 17.06,41.59 17.63,41.02 17.63,40.64 48.79,9.47 48.79,9.16 48.91,9.05 49.22,9.05 49.33,8.93 49.33,8.62 49.44,8.51 49.76,8.51 49.87,8.39 49.87,8.08 49.98,7.97 50.29,7.97 52.61,5.65 54.4,5.65 56.3,7.55 56.67,7.55 56.81,7.41 v1(57.15,7.41)
DP_A_L2N: length 104.4
  Top Layer w0.165: J1.265 11.41,34.87 11.98,35.43 C23.1 ; v1(64.8,2.09) 64.68,2.21 64.68,3.81 65.16,4.29 U2.SJ2 ; C23.2 11.98,41.53 11.75,41.75 11.75,42.96 13.63,44.83 50.51,44.83 v1(59.25,36.09)
  Bottom Layer w0.165: v1(64.8,2.09) 65.45,2.75 65.65,2.75 66.01,3.11 66.01,3.29 66.19,3.47 66.37,3.47 66.55,3.65 66.55,3.83 66.73,4.01 66.91,4.01 67.09,4.19 67.09,4.37 67.27,4.55 67.45,4.55 68.41,5.51 68.41,27.13 59.68,35.86 59.48,35.86 v1(59.25,36.09)
DP_A_L2P: length 104.4
  Top Layer w0.165: C22.1 10.91,36.21 J1.267 ; v1(65.6,2.05) 65,2.65 65,3.49 65.2,3.69 U2.SK2 ; v1(59.67,36.52) 51.04,45.15 13.5,45.15 11.44,43.09 11.44,41.75 11.21,41.53 11.21,37.91 C22.2
  Bottom Layer w0.165: v1(59.67,36.52) 59.91,36.28 59.91,36.08 68.73,27.26 68.73,5.38 65.88,2.52 65.88,2.32 v1(65.6,2.05)
DP_A_L3N: length 99.4
  Top Layer w0.165: J1.271 9.91,39.21 C21.1 ; v1(64.29,6.35) 64.55,6.09 U2.SF2 ; v1(10.07,42.04) 10.07,40.96 C21.2
  Bottom Layer w0.165: v1(64.29,6.35) 64.29,6.37 64.21,6.44 64.21,7.1 64.43,7.31 64.43,7.48 64.21,7.69 64.21,7.86 64.43,8.08 64.43,8.24 64.21,8.46 64.21,8.62 64.43,8.84 64.43,9 64.21,9.22 64.21,9.38 64.43,9.6 64.43,9.77 64.21,9.98 64.21,10.37 61.51,13.08 61.51,14.01 61.62,14.13 62.43,14.13 62.54,14.24 62.54,14.39 62.43,14.51 61.62,14.51 61.51,14.62 61.51,14.77 61.62,14.89 62.43,14.89 62.54,15 62.54,15.15 62.43,15.27 61.62,15.27 61.51,15.39 61.51,31.37 52.24,40.64 45.72,40.64 45.69,40.61 45.31,40.61 45.28,40.64 20.74,40.64 17.18,44.2 10.33,44.2 10.07,43.94 v1(10.07,42.04)
DP_A_L3P: length 99.4
  Top Layer w0.165: U2.SG2 65.3,5.49 65,5.19 65,4.76 64.5,4.27 v1(64.17,4.27) ; v1(10.53,43.56) 8.87,43.56 C20.2 ; J1.273 9.41,37.62 9.06,37.97 9.06,41.97 C20.1
  Bottom Layer w0.165: v1(64.17,4.27) 63.81,4.63 63.81,5.08 63.83,5.09 63.83,7.73 63.9,7.8 63.9,10.24 61.19,12.95 61.19,31.24 52.1,40.32 45.86,40.32 45.83,40.29 45.18,40.29 45.15,40.32 20.61,40.32 17.05,43.88 11.09,43.88 10.77,43.56 v1(10.53,43.56)
FAN1_PWM: length 49.2
  Top Layer w0.254: U2.PK5 43.31,3.33 43.66,3.33 43.85,3.13 43.85,1.52 44.87,0.51 83.83,0.51 87.37,4.05 87.37,4.6 87.53,4.76 88.08,4.76 FPC3.2
FAN1_SPEED: length 46.6
  Top Layer w0.254: FPC3.3 88.08,5.26 87.53,5.26 83.16,0.89 79.54,0.89 v1(79.16,1.27) ; v1(47.66,4.06) 48.92,4.06 U2.PJ2
  Inner3 w0.254: v1(47.66,4.06) 47.66,2.29 49.44,0.51 78.4,0.51 v1(79.16,1.27)
FAN2_PWM: length 40.4
  Top Layer w0.254: FPC4.2 18.71,5.33 23.53,0.51 40.94,0.51 42.96,2.53 42.96,2.62 U2.PL5
FAN2_SPEED: length 47.4
  Top Layer w0.254: U2.PH2 48.85,4.57 v1(48.3,4.57) ; FPC4.3 18.58,4.83 21.12,2.29 v1(21.12,1.65)
  Inner2 w0.254: v1(48.3,4.57) 48.3,3.94 44.87,0.51 37.25,0.51 36.11,1.65 v1(21.12,1.65)
PCIE_RX_0N: length 50.5
  Top Layer w0.165: v2(41.95,36.96) 40.91,35.92 J1.147 ; U2.SE8 54.22,6.69 v2(54.14,6.61)
  Bottom Layer w0.165: v2(41.95,36.96) 43.66,38.67 50.96,38.67 53.31,36.32 53.31,16.52 53.2,16.4 53.18,16.4 53.06,16.28 53.06,16.14 53.18,16.02 53.2,16.02 53.31,15.9 53.31,15.75 53.2,15.64 53.18,15.64 53.06,15.52 53.06,15.37 53.18,15.26 53.2,15.26 53.31,15.14 53.31,7.43 v2(54.14,6.61)
PCIE_RX_0P: length 50.4
  Top Layer w0.165: J1.149 40.41,36.24 v2(41.03,36.86) ; v2(54.14,7.37) 54.22,7.29 U2.SD8
  Bottom Layer w0.165: v2(54.14,7.37) 53.63,7.88 53.63,36.45 51.09,38.99 43.16,38.99 v2(41.03,36.86)
PCIE_RX_1N: length 46
  Top Layer w0.165: v2(52.41,9.09) 53.02,8.49 U2.SB8 ; J1.141 42.41,35.26 v2(42.71,35.56)
  Bottom Layer w0.165: v2(42.71,35.56) 43,35.85 43,36.17 44.59,37.75 50.49,37.75 52.34,35.9 52.34,16.23 52.19,16.08 52.19,15.85 52.34,15.7 52.34,15.47 52.19,15.32 52.19,15.09 52.34,14.94 52.34,14.71 52.19,14.56 52.19,14.32 52.34,14.18 52.34,10.39 52.11,10.16 52.11,9.4 v2(52.41,9.09)
PCIE_RX_1P: length 46
  Top Layer w0.165: v2(42.17,36.1) 41.91,35.84 J1.143 ; v2(52.65,9.85) 53.55,8.95 55.09,8.95 55.23,9.09 U2.SA8
  Bottom Layer w0.165: v2(52.65,9.85) 52.72,9.92 52.73,9.92 52.65,10 52.65,36.03 50.62,38.07 44.45,38.07 42.78,36.39 42.46,36.39 v2(42.17,36.1)
PCIE_RX_2N: length 57.2
  Top Layer w0.165: v1(58.19,6.81) 58.31,6.69 U2.SE6 ; J1.135 43.91,33.48 v1(43.96,33.53)
  Bottom Layer w0.165: v1(58.19,6.81) 57.92,7.07 57.92,7.6 58.19,7.87 58.2,7.87 58.65,8.32 58.65,32.38 51.48,39.55 42.45,39.55 40.11,37.21 40.11,35.56 41.66,34.01 43.53,34.01 43.82,33.72 43.82,33.67 v1(43.96,33.53)
PCIE_RX_2P: length 57
  Top Layer w0.165: U2.SD6 58.5,7.29 v1(58.38,7.41) ; J1.137 43.41,33.48 v1(43.36,33.53)
  Bottom Layer w0.165: v1(58.38,7.41) 58.97,8 58.97,32.51 51.61,39.86 42.32,39.86 39.79,37.34 39.79,35.43 41.69,33.53 v1(43.36,33.53)
PCIE_RX_3N: length 33.8
  Top Layer w0.165: U2.SB6 58.61,8.49 58.2,8.89 58.2,11.56 55.16,14.61 52.36,14.61 44.64,22.33 v1(44.64,25.4) ; J1.121 47.41,29.85 v1(46.65,29.08)
  Bottom Layer w0.165: v1(46.65,29.08) 46.14,29.08 45.76,29.46 45.38,29.46 44.64,28.72 v1(44.64,25.4)
PCIE_RX_3P: length 33.8
  Top Layer w0.165: J1.123 46.91,30.11 v1(45.63,28.83) ; U2.SA6 58.98,9.58 58.87,9.7 58.69,9.7 58.57,9.81 58.57,9.96 58.69,10.08 58.87,10.08 58.98,10.19 58.98,10.34 58.87,10.46 58.69,10.46 58.57,10.58 58.57,10.72 58.69,10.84 58.87,10.84 58.98,10.96 58.98,11.23 58.63,11.58 58.63,11.76 58.46,11.94 58.27,11.94 58.09,12.12 58.09,12.3 57.92,12.48 57.73,12.48 57.56,12.66 57.56,12.84 57.38,13.02 57.19,13.02 57.02,13.19 57.02,13.38 56.84,13.56 56.66,13.56 56.48,13.73 56.48,13.92 56.3,14.09 56.12,14.09 55.94,14.27 55.94,14.46 55.76,14.63 55.58,14.63 55.29,14.92 54.87,14.92 54.75,15.05 54.49,15.05 54.37,14.92 54.11,14.92 53.99,15.05 53.73,15.05 53.6,14.92 53.35,14.92 53.22,15.05 52.97,15.05 52.84,14.92 52.49,14.92 49.66,17.75 49.66,17.92 49.67,17.92 49.67,18.09 49.56,18.19 49.4,18.19 49.39,18.19 49.23,18.19 49.12,18.29 49.12,18.46 49.13,18.46 49.13,18.63 49.02,18.73 48.86,18.73 48.85,18.73 48.69,18.73 48.58,18.83 48.58,19 48.59,19 48.59,19.17 48.48,19.27 48.32,19.27 48.31,19.27 48.15,19.27 45.1,22.32 45.1,25.75 v1(45.12,25.78)
  Bottom Layer w0.165: v1(45.63,28.83) 45.12,28.32 v1(45.12,25.78)
PCIE_RX_4N: length 32.7
  Top Layer w0.165: v1(48.81,29.97) 48.91,30.08 J1.115 ; v1(50.84,18.16) 53.12,15.88 53.56,15.88 53.71,15.73 53.94,15.73 54.09,15.88 54.32,15.88 54.47,15.73 54.7,15.73 54.85,15.88 55.08,15.88 55.23,15.73 55.46,15.73 55.61,15.88 55.79,15.88 56.08,15.59 56.08,15.34 56.22,15.19 56.47,15.19 56.62,15.05 56.62,14.8 56.76,14.66 57.01,14.66 57.15,14.51 57.15,14.26 57.3,14.12 57.55,14.12 57.69,13.97 57.69,13.72 57.84,13.58 58.09,13.58 58.23,13.44 58.23,13.18 58.37,13.04 58.63,13.04 58.77,12.9 58.77,12.64 58.91,12.5 59.17,12.5 59.31,12.36 59.31,12.1 59.45,11.96 59.71,11.96 59.85,11.82 59.85,11.57 59.99,11.42 60.24,11.42 60.39,11.28 60.39,11.03 60.53,10.88 60.78,10.88 61.14,10.53 61.7,10.53 62.71,9.52 62.73,9.52 62.87,9.39 62.87,9.36 U2.SA3
  Bottom Layer w0.165: v1(48.81,29.97) 48.99,29.97 50.37,28.59 50.37,18.63 v1(50.84,18.16)
PCIE_RX_4P: length 32.9
  Top Layer w0.165: U2.SB3 63.43,8.49 63.73,8.79 63.73,9.47 63.16,10.03 62.65,10.03 61.83,10.86 61.26,10.86 55.92,16.19 53.31,16.19 51.35,18.16 v1(51.35,18.54) ; J1.117 48.41,30.72 v1(48.3,30.61)
  Bottom Layer w0.165: v1(48.3,30.61) 48.81,30.61 48.98,30.43 49,30.43 49.27,30.16 49.27,30.15 50.69,28.72 50.69,19.2 v1(51.35,18.54)
PCIE_RX_5N: length 40.7
  Top Layer w0.165: J1.109 50.41,33.61 51.22,34.42 v1(54.27,34.42) ; U2.SD3 63.6,7.29 63.74,7.15 63.85,7.15 64,7.29 64,7.5 63.78,7.71 63.78,7.88 64,8.1 64,9.96 63.49,10.46 63.31,10.46 63.13,10.64 63.13,10.82 63.02,10.93 62.7,10.93 62.59,11.04 62.59,11.36 62.4,11.56 61.51,11.56 61.23,11.83 61.23,12.01 61.05,12.19 60.87,12.19 60.69,12.37 60.69,12.55 60.51,12.73 60.33,12.73 60.15,12.91 60.15,13.09 59.97,13.27 59.79,13.27 59.61,13.45 59.61,13.63 59.43,13.81 59.25,13.81 59.07,13.99 59.07,14.17 58.9,14.35 58.72,14.35 58.54,14.53 58.54,14.71 58.36,14.89 58.18,14.89 58,15.07 58,15.25 57.82,15.43 57.64,15.43 57.19,15.88 v1(57.19,16.13)
  Bottom Layer w0.165: v1(57.19,16.13) 57.38,16.32 57.38,16.59 57.26,16.71 57.26,16.71 57.14,16.83 57.14,16.97 57.26,17.09 57.26,17.09 57.38,17.21 57.38,17.35 57.26,17.47 57.26,17.47 57.14,17.59 57.14,17.73 57.26,17.85 57.26,17.85 57.38,17.97 57.38,18.12 57.26,18.23 57.26,18.23 57.14,18.35 57.14,18.5 57.26,18.61 57.26,18.61 57.38,18.73 57.38,32 54.96,34.42 v1(54.27,34.42)
PCIE_RX_5P: length 40.8
  Top Layer w0.165: U2.SE3 63.6,6.69 63.74,6.83 63.98,6.83 64.31,7.16 64.31,10.09 62.53,11.87 61.82,11.87 57.79,15.91 v1(57.79,15.95) ; J1.111 49.95,32.11 49.95,33.91 51.09,35.05 v1(54.78,35.05)
  Bottom Layer w0.165: v1(54.78,35.05) 57.7,32.13 57.7,17.14 57.79,17.05 v1(57.79,15.95)
PCIE_RX_6N: length 43.7
  Top Layer w0.165: J1.103 51.91,30.53 v1(51.73,30.35) ; v1(51.6,29.21) 52.04,29.21 52.99,28.26 56.55,28.26 57.76,27.05 57.76,23.05 62.65,18.16 67.09,18.16 72.68,12.57 72.68,10.03 71.6,8.95 70.24,8.95 70.12,9.06 70.12,9.15 70,9.26 69.86,9.26 69.74,9.15 69.74,9.06 69.62,8.95 69.48,8.95 69.36,9.06 69.36,9.15 69.24,9.26 69.09,9.26 68.98,9.15 68.98,9.06 68.86,8.95 68.71,8.95 68.6,9.06 68.6,9.15 68.48,9.26 68.33,9.26 68.22,9.15 68.22,9.06 68.1,8.95 67.04,8.95 66.9,9.09 U2.SA1
  Bottom Layer w0.165: v1(51.73,30.35) 51.6,30.23 v1(51.6,29.21)
PCIE_RX_6P: length 43.7
  Top Layer w0.165: J1.105 51.41,31.05 50.97,30.61 50.97,30.1 51.35,29.72 51.98,29.72 53.12,28.58 56.68,28.58 58.08,27.18 58.08,23.18 62.78,18.48 67.23,18.48 73,12.7 73,9.9 71.73,8.63 67.04,8.63 66.9,8.49 U2.SB1
PCIE_RX_7N: length 46.9
  Top Layer w0.165: U2.SE1 66.9,6.69 67.04,6.83 67.28,6.83 67.31,6.86 73.07,6.86 74.97,8.76 74.97,13.21 68.49,19.69 63.16,19.69 59.6,23.24 59.6,27.69 57.44,29.84 53.89,29.84 53.32,30.41 53.32,30.87 53.41,30.97 J1.97
PCIE_RX_7P: length 46.9
  Top Layer w0.165: J1.99 52.91,30.97 53,30.87 53,30.28 53.75,29.53 57.31,29.53 59.28,27.55 59.28,23.11 63.03,19.37 68.36,19.37 74.65,13.08 74.65,8.89 72.94,7.18 71.28,7.18 71.15,7.3 70.9,7.3 70.77,7.18 70.52,7.18 70.39,7.3 70.13,7.3 70.01,7.18 69.75,7.18 69.63,7.3 69.37,7.3 69.25,7.18 68.99,7.18 68.86,7.3 68.61,7.3 68.48,7.18 68.23,7.18 68.1,7.3 67.85,7.3 67.72,7.18 67.18,7.18 67.15,7.15 67.04,7.15 66.9,7.29 U2.SD1
PCIE_TX_0N: length 27.5
  Top Layer w0.165: J1.148 40.66,22.37 v2(40.93,22.1) ; v2(42.84,20.19) 42.84,20 46.76,16.08 46.76,15.81 46.89,15.68 47.16,15.68 47.3,15.54 47.3,15.28 47.43,15.14 47.7,15.14 47.84,15 47.84,14.74 47.97,14.6 48.24,14.6 48.37,14.47 48.37,14.2 48.51,14.06 48.78,14.06 48.91,13.93 48.91,13.66 49.05,13.52 49.32,13.52 51.54,11.3 51.54,8 54.5,5.03 55.09,5.03 55.23,4.89 U2.SH8
  Bottom Layer w0.165: v2(42.84,20.19) v2(40.93,22.1)
PCIE_TX_0P: length 27.5
  Top Layer w0.165: v2(44.11,19.56) 44.11,19.18 51.85,11.43 51.85,8.13 54.63,5.35 55.09,5.35 55.23,5.49 U2.SG8 ; J1.150 40.16,21.86 v2(41.19,20.83)
  Bottom Layer w0.165: v2(41.19,20.83) 42.46,19.56 v2(44.11,19.56)
PCIE_TX_1N: length 28.9
  Top Layer w0.165: U2.SL8 55.23,3.09 55.09,3.23 54.27,3.23 50.65,6.85 50.65,9.75 44.72,15.68 44.72,15.84 44.74,15.87 44.74,16.03 44.64,16.14 44.47,16.14 44.45,16.11 44.28,16.11 44.18,16.22 44.18,16.38 44.2,16.41 44.2,16.57 44.1,16.68 43.93,16.68 43.91,16.65 43.74,16.65 43.64,16.76 43.64,16.92 43.66,16.94 43.66,17.11 43.56,17.21 43.39,17.21 43.37,17.19 43.21,17.19 42.07,18.33 42.07,23.62 42.16,23.72 J1.142
PCIE_TX_1P: length 28.9
  Top Layer w0.165: v2(50.11,11.21) 50.11,10.89 50.97,10.03 50.97,6.98 54.4,3.55 55.09,3.55 55.23,3.69 U2.SK8 ; J1.144 41.66,23.72 41.75,23.62 41.75,18.2 47.79,12.16 v2(47.79,11.81)
  Bottom Layer w0.165: v2(47.79,11.81) 48.4,11.21 v2(50.11,11.21)
PCIE_TX_2N: length 28.4
  Top Layer w0.165: J1.136 43.66,23.72 43.57,23.62 43.57,21.88 51.98,13.46 54.9,13.46 57.92,10.44 57.92,9.65 57.8,9.53 57.6,9.53 57.49,9.41 57.49,9.27 57.6,9.15 57.8,9.15 57.92,9.03 57.92,7.21 57.73,7.02 57.73,6.46 58.7,5.49 U2.SG6
PCIE_TX_2P: length 28.4
  Top Layer w0.165: v1(57.44,10.16) 57.44,10.47 54.77,13.14 51.85,13.14 43.25,21.74 43.25,23.62 43.16,23.72 J1.138 ; U2.SH6 58.65,4.89 v1(57.95,5.59)
  Bottom Layer w0.165: v1(57.44,10.16) 57.65,9.95 57.65,5.88 v1(57.95,5.59)
PCIE_TX_3N: length 74.1
  Top Layer w0.165: v1(26.4,27.07) 26.63,27.31 26.84,27.31 27.47,27.94 45.89,27.94 47.57,26.26 47.57,26.02 47.66,25.93 J1.120 ; U2.SL6 58.51,3.09 v1(58.43,3.01)
  Bottom Layer w0.165: v1(26.4,27.07) 26.17,26.84 26.17,26.63 25.6,26.07 25.6,24.63 26.36,23.88 29.38,23.88 39.41,13.84 39.41,5.46 42.27,2.6 50.31,2.6 50.34,2.63 51.17,2.63 51.2,2.6 57.83,2.6 58,2.77 58.2,2.77 v1(58.43,3.01)
PCIE_TX_3P: length 74.2
  Top Layer w0.165: v1(58.01,3.43) 58.26,3.69 U2.SK6 ; J1.122 47.16,25.93 47.25,26.02 47.25,26.13 45.76,27.62 27.6,27.62 27.06,27.08 27.06,26.88 v1(26.83,26.64)
  Bottom Layer w0.165: v1(58.01,3.43) 57.77,3.2 57.77,3 57.7,2.92 51.33,2.92 51.3,2.95 50.2,2.95 50.18,2.92 48.92,2.92 48.8,3.04 48.8,3.17 48.68,3.29 48.54,3.29 48.42,3.17 48.42,3.04 48.3,2.92 48.16,2.92 48.04,3.04 48.04,3.17 47.92,3.29 47.77,3.29 47.66,3.17 47.66,3.04 47.54,2.92 47.39,2.92 47.28,3.04 47.28,3.17 47.16,3.29 47.01,3.29 46.9,3.17 46.9,3.04 46.78,2.92 42.4,2.92 39.73,5.59 39.73,13.97 29.51,24.19 26.49,24.19 25.92,24.77 25.92,25.94 26.39,26.41 26.59,26.41 v1(26.83,26.64)
PCIE_TX_4N: length 35.5
  Top Layer w0.165: v1(66.13,12.45) 65.44,12.45 65.33,12.57 65.33,12.77 65.21,12.89 65.06,12.89 64.95,12.77 64.95,12.57 64.83,12.45 64.68,12.45 64.57,12.57 64.57,12.77 64.45,12.89 64.3,12.89 64.18,12.77 64.18,12.57 64.07,12.45 63.28,12.45 62.49,13.24 62.05,13.24 56.24,19.05 53.38,19.05 49.16,23.27 J1.114 ; U2.SK3 63.63,3.69 v1(63.75,3.81)
  Bottom Layer w0.165: v1(63.75,3.81) 64.08,3.81 64.22,3.67 64.67,3.67 66.21,5.21 66.21,8.51 65.86,8.86 65.86,12.17 v1(66.13,12.45)
PCIE_TX_4P: length 35.5
  Top Layer w0.165: v1(66.56,11.9) 63.38,11.9 62.49,12.79 62.05,12.79 56.11,18.73 53.19,18.73 48.66,23.26 J1.116 ; U2.SL3 63.63,3.09 v1(63.75,3.21)
  Bottom Layer w0.165: v1(66.56,11.9) 66.18,11.51 66.18,8.99 66.52,8.64 66.52,5.08 64.8,3.35 64.22,3.35 64.08,3.21 v1(63.75,3.21)
PCIE_TX_5N: length 29.9
  Top Layer w0.165: v1(64.27,4.89) 63.15,4.89 U2.SH3 ; v1(64.04,13.93) 63.81,14.16 63.6,14.16 62.65,15.11 61.51,15.11 56.55,20.07 54.02,20.07 50.57,23.52 50.57,23.62 50.66,23.72 J1.108
  Bottom Layer w0.165: v1(64.27,4.89) 64.62,4.89 65.06,5.33 65.06,12.7 64.28,13.49 64.28,13.69 v1(64.04,13.93)
PCIE_TX_5P: length 29.9
  Top Layer w0.165: v1(64.52,5.49) 64.52,5.49 U2.SG3 ; v1(63.61,13.5) 63.38,13.74 63.38,13.94 62.52,14.8 61.38,14.8 56.42,19.75 53.89,19.75 50.25,23.39 50.25,23.62 50.16,23.72 J1.110
  Bottom Layer w0.165: v1(63.61,13.5) 63.85,13.27 64.05,13.27 64.75,12.57 64.75,12.29 64.63,12.17 64.33,12.17 64.22,12.06 64.22,11.91 64.33,11.79 64.63,11.79 64.75,11.68 64.75,5.72 v1(64.52,5.49)
PCIE_TX_6N: length 37
  Top Layer w0.165: U2.SK1 68.75,3.69 v1(69,3.94) ; v1(70.65,11.3) 70.65,11.81 68.12,14.35 68.12,14.53 67.94,14.7 67.76,14.7 67.58,14.88 67.58,15.06 67.4,15.24 67.22,15.24 67.04,15.42 67.04,15.6 66.86,15.78 66.68,15.78 66.33,16.13 65.99,16.13 65.84,16.28 65.61,16.28 65.45,16.13 65.23,16.13 65.07,16.28 64.85,16.28 64.69,16.13 64.47,16.13 64.31,16.28 64.08,16.28 63.93,16.13 63.7,16.13 63.55,16.28 63.32,16.28 63.17,16.13 62.94,16.13 62.79,16.28 62.56,16.28 62.41,16.13 61.89,16.13 56.93,21.08 54.5,21.08 52.07,23.52 52.07,23.62 52.16,23.72 J1.102
  Bottom Layer w0.165: v1(69,3.94) 69,8.76 70.19,9.95 70.19,9.97 70.46,10.24 70.47,10.24 70.65,10.41 v1(70.65,11.3)
PCIE_TX_6P: length 36.9
  Top Layer w0.165: J1.104 51.66,23.72 51.75,23.62 51.75,23.39 54.37,20.76 56.8,20.76 61.76,15.81 66.2,15.81 69.95,12.06 69.95,10.48 v1(70.65,9.78) ; U2.SL1 66.48,3.05 v1(69,3.05)
  Bottom Layer w0.165: v1(69,3.05) 69.63,3.68 69.63,8.76 v1(70.65,9.78)
PCIE_TX_7N: length 36.3
  Top Layer w0.165: J1.96 53.66,23.72 53.57,23.62 53.57,23.52 54.86,22.22 57.44,22.22 62.4,17.27 66.71,17.27 71.67,12.32 71.67,11.05 71.81,10.91 v1(71.81,10.58) ; v1(70.14,5.1) 69.93,4.89 U2.SH1
  Bottom Layer w0.165: v1(71.81,10.58) 71.81,10.24 71.67,10.1 71.67,5.84 71.07,5.24 70.62,5.24 70.47,5.1 v1(70.14,5.1)
PCIE_TX_7P: length 36.3
  Top Layer w0.165: v1(70.14,5.7) 70,5.56 66.51,5.56 U2.SG1 ; v1(71.21,10.58) 71.21,10.91 71.35,11.05 71.35,12.19 66.58,16.95 62.26,16.95 57.31,21.91 54.73,21.91 53.25,23.39 53.25,23.62 53.16,23.72 J1.98
  Bottom Layer w0.165: v1(71.21,10.58) 71.21,10.24 71.35,10.1 71.35,8.5 71.23,8.38 71.07,8.38 70.95,8.27 70.95,8.12 71.07,8 71.23,8 71.35,7.88 71.35,5.97 70.93,5.56 70.62,5.56 70.47,5.7 v1(70.14,5.7)
PEX_CLK_REQ-: length 34.3
  Top Layer w0.254: J1.154 39.16,26.04 40.04,26.92 44.87,26.92 45.76,26.03 45.76,22.48 52.87,15.37 55.54,15.37 60.87,10.03 61.63,10.03 62.28,9.38 U2.SA4
PEX_REFCLK+: length 62.6
  Top Layer w0.165: v1(56.81,37.34) 52.55,41.59 42.45,41.59 38.91,38.05 38.91,35.67 38.79,35.55 38.37,35.55 38.25,35.44 38.25,35.29 38.37,35.17 38.79,35.17 38.91,35.06 38.91,34.91 38.79,34.79 38.37,34.79 38.25,34.68 38.25,34.53 38.37,34.41 38.79,34.41 38.91,34.3 J1.155
  Bottom Layer w0.165: v1(56.81,37.34) 57.32,37.34 65.51,29.15 65.51,7.97 v1(65.58,7.89)
PEX_REFCLK-: length 62.6
  Top Layer w0.165: v1(59.29,34.23) 59.15,34.23 52.11,41.28 42.58,41.28 39.41,38.1 J1.153 ; v1(64.94,14.86) 67.15,12.65 67.15,11.58 66.88,11.31 66.72,11.31 64.81,9.4 64.81,7.62 65.14,7.29 U2.SD2
  Bottom Layer w0.165: v1(59.29,34.23) 59.97,34.23 65.19,29.02 65.19,15.11 v1(64.94,14.86)
PEX_RST: length 30.2
  Top Layer w0.254: v1(59.73,9.91) 59.73,9.2 U2.SA5 ; J1.156 38.66,22.87 v1(38.65,22.86)
  Inner2 w0.254: v1(38.65,22.86) 48.43,22.86 59.73,11.56 v1(59.73,9.91)
PNL_BL_EN: length 39.2
  Top Layer w0.254: J1.25 71.41,34.16 v1(71.41,34.16) ; v1(63.67,2.29) 62.65,2.29 62.28,2.65 U2.SL4
  Inner2 w0.254: v1(71.41,34.16) 71.41,29.34 67.48,25.4 67.48,11.87 66.4,10.8 66.33,10.8 66.15,10.62 66.15,4.77 v1(63.67,2.29)
PNL_BL_PWM: length 34
  Top Layer w0.254: v1(61.56,3.09) 61.65,3.19 61.65,3.4 61.82,3.57 62.08,3.57 62.2,3.69 U2.SK4 ; v1(70.4,30.23) 70.91,30.74 J1.27
  Inner2 w0.254: v1(70.4,30.23) 63.03,22.86 63.03,4.57 v1(61.56,3.09)
PNL_PWR_EN: length 40.7
  Top Layer w0.254: J1.23 71.91,30.85 v1(70.4,29.34) ; U2.SK5 59.84,3.61 59.89,3.57 60.31,3.57 60.47,3.4 60.47,3.34 v1(60.72,3.09)
  Inner2 w0.152: v1(60.72,3.09) 59.86,2.22 59.86,1.52 60.61,0.77 61.51,0.77 63.03,2.29 63.03,3.81 63.41,4.19 63.41,12.06 65.44,14.1 65.44,24.38 v1(70.4,29.34)
PWR_EN: length 56.6
  Top Layer w0.254: U2.PK2 48.45,3.45 48.04,3.05 48.04,2.79 v1(48.93,1.91) ; J1.8 75.66,23.55 v1(74.84,22.73) 74.59,22.73 73.19,21.34 73.19,20.45 74.14,19.5 PWR_EN.1
  Inner2 w0.254: v1(48.93,1.91) 50.38,0.46 67.81,0.46 74.84,7.49 v1(74.84,22.73)
PWR_GOOD: length 52.3
  Top Layer w0.254: 49.79,2.85 51.67,2.85 v1(52.49,2.03) ; J1.6 76.16,23.29 v1(73.95,21.08) 73.95,20.7 PWR_GOOD.1
  Bottom Layer w0.254: v1(73.95,21.08) 73.95,6.35 68.37,0.77 60.65,0.77 60.53,0.89 58.59,0.89 57.19,2.29 52.74,2.29 v1(52.49,2.03)
PWR_LEVEL: length 26.2
  Top Layer w0.254: v1(61.38,8.89) 61.78,8.49 U2.SB4 ; J1.18 73.16,22.45 v1(71.54,20.83) 71.79,20.57 PWR_LEVEL.1
  Inner3 w0.254: v1(61.38,8.89) 62.14,8.13 63.5,8.13 67.22,11.85 67.22,16.51 v1(71.54,20.83)
SMB_CLK: length 43.4
  Top Layer w0.254: U2.PF3 47.16,5.85 v1(47.41,6.1) ; SMBCLK.1 69.16,23.43 J1.34 69.16,26.64 67.98,27.81 v1(66.46,27.81)
  Inner2 w0.254: v1(47.41,6.1) 51.35,6.1 54.39,9.14 59.68,9.14 60.23,9.7 60.23,9.9 60.24,9.91 60.24,10.02 60.23,10.02 60.23,21.2 66.46,27.43 v1(66.46,27.81)
